# EAGLE design DFROBOT DS3231M (EAGLE 9.7.0)
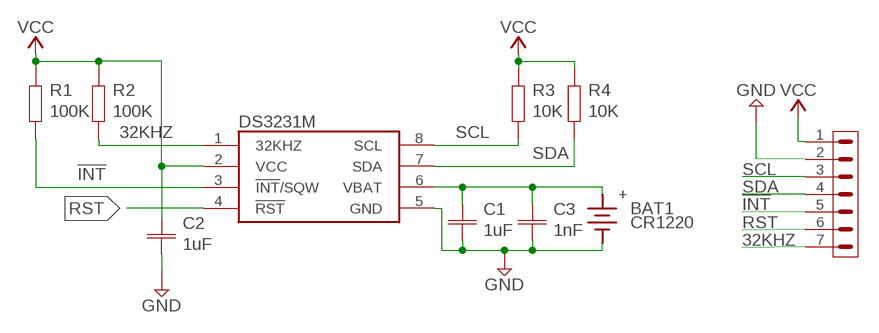
[diagram p0: schematic, sheet 1]

## Parts
BAT1  CR1220  S8411-45R  [S8411-45R]
C1  1uF  C_CHIP-0402(1005-METRIC)  [CAPC1005X60]
C2  1uF  C_CHIP-0402(1005-METRIC)  [CAPC1005X60]
C3  1nF  C_CHIP-0402(1005-METRIC)  [CAPC1005X60]
DS3231M  DS3231MZ+  [SOIC127P600X175-8N]
JP1  PINHD-1X7  DS3231M_HEADERFEMALE  [DS3231M_HEADER]
R1  100K  R_CHIP-0402(1005-METRIC)  [RESC1005X40]
R2  100K  R_CHIP-0402(1005-METRIC)  [RESC1005X40]
R3  10K  R_CHIP-0402(1005-METRIC)  [RESC1005X40]
R4  10K  R_CHIP-0402(1005-METRIC)  [RESC1005X40]

## Nets
32KHZ: DS3231M.1(32KHZ) JP1.7 R2.2
!INT: DS3231M.3(!INT!/SQW) JP1.5 R1.2
GND: BAT1.1(-) C1.2 C2.2 C3.2 DS3231M.5(GND) JP1.2
RST: DS3231M.4(!RST) JP1.6
SCL: DS3231M.8(SCL) JP1.3 R3.2
SDA: DS3231M.7(SDA) JP1.4 R4.2
VBAT: BAT1.2(+) C1.1 C3.1 DS3231M.6(VBAT)
VCC [POWER]: C2.1 DS3231M.2(VCC) JP1.1 R1.1 R2.1 R3.1 R4.1

## Library data of the parts
BAT1 = RTC DFRobot DS3231M:S8411-45R: CR1220 Coin cell battery holder
C1-C3 = Capacitor:C: Capacitor - Generic; CATEGORY: Capacitor; PACKAGE_SIZE: 0402; PACKAGE_TYPE: Surface Mount; SUBCATEGORY: Ceramic Capacitors; TYPE: MLCC
DS3231M = RTC DFRobot DS3231M:DS3231MZ+: Real Time Clock 5+/-ppm RTC Source: Datasheet <http://datasheets.maximintegrated.com/en/ds/DS3231M.pdf>; DESCRIPTION: Real Time Clock 5+/-ppm RTC; HEIGHT: 1.75mm; MANUFACTURER_NAME: Analog Devices; MANUFACTURER_PART_NUMBER: DS3231MZ+; MOUSER_PART_NUMBER: 700-DS3231MZ+; MOUSER_PRICE-STOCK: https://www.mouser.co.uk/ProductDetail/Analog-Devices-Maxim-Integrated/DS3231MZ%2b?qs=4Rc5iGDDRGgASPOHxzykqQ%3D%3D
JP1 = RTC DFRobot DS3231M:DS3231M_HEADER; CATEGORY: Connectors; DESCRIPTION: Header-Straight-7 Position; PACKAGE_TYPE: Through Hole; PITCH: 0.100" (2.54mm); SUBCATEGORY: Headers; TYPE: Male Pins
R1-R4 = Resistor:R: Resistor Fixed - Generic; CATEGORY: Resistors; DESCRIPTION: Chip Resistor 1.05 X 0.54 X 0.40 mm body 0402(1005-METRIC) Package; PACKAGE_SIZE: 0402; PACKAGE_TYPE: Surface Mount

## Board
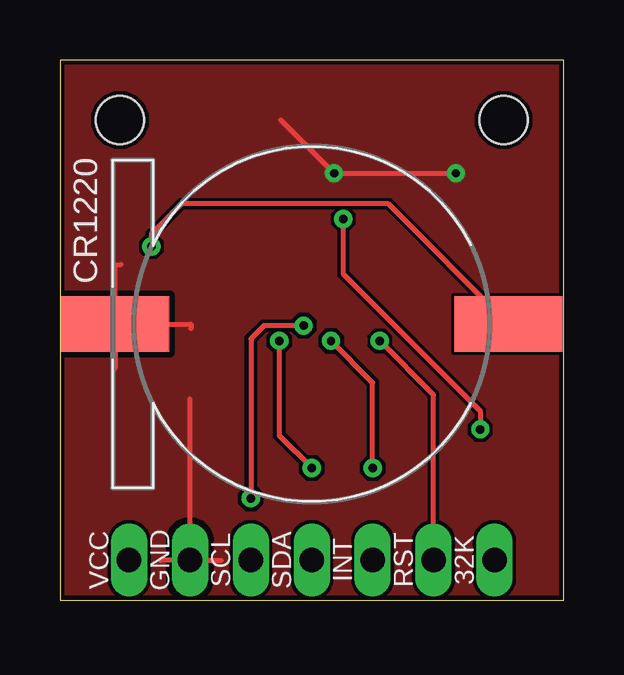
[diagram p1: board, top side]
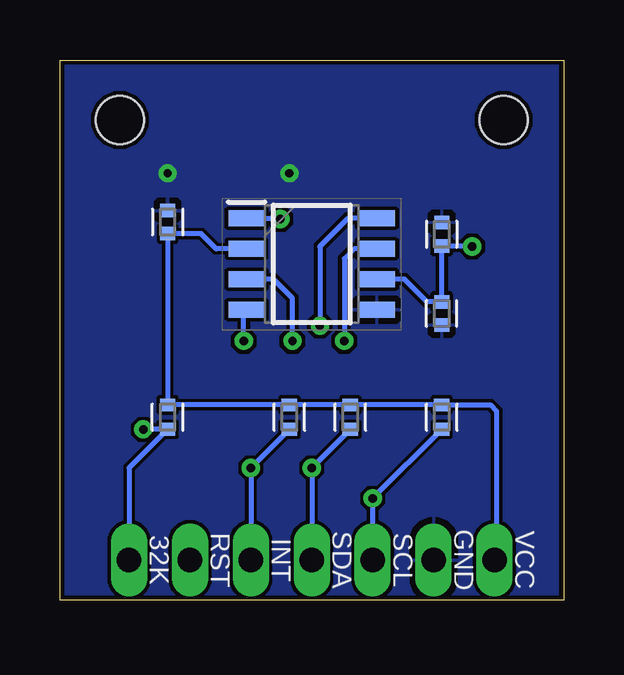
[diagram p2: board, bottom side, seen from below]

Size 21 x 22.5 mm. Coordinates in mm from the lower left corner, seen from the top.
Outline: 0,0 21,0 21,22.5 0,22.5 0,0
Copper layers (1*16): Top / Bottom
Stack-up Default Layer Stack: Top User Defined 0.035mm / Dielectric-1 User Defined 1.5mm / Bottom User Defined 0.035mm
Design rules: minimum copper width 6mil, minimum drill size 0.35mm, copper clearance wire_polygon to wire_polygon 6mil, copper clearance wire_polygon to pad_smd 6mil, copper clearance wire_polygon to via 6mil, copper clearance pad_smd to pad_smd 6mil, copper clearance pad_smd to via 6mil, copper clearance via to via 6mil, copper clearance smd to pad (same net) 6mil, copper clearance smd to via (same net) 6mil, copper clearance smd to smd (same net) 6mil, dimension clearance all to all 0.2mm, dimension clearance 40mil, restrict clearance 0mil, via restrict clearance 0mil, drill distance 6mil, keepout clearance 0mil
Holes 2 mm at 2.5,20 18.5,20

### Footprints (pad centres in the part's own frame; a part is rotated, then mirrored left to right if it is on the bottom)
S8411-45R = smd 2.3 x 4.5: 1 0,-6.93; 2 0,9.47
CAPC1005X60 = smd 0.56 x 0.629: 1 -0.485,0; 2 0.485,0
SOIC127P600X175-8N = smd 1.525 x 0.65: 1 -2.712,1.905; 2 -2.712,0.635; 3 -2.712,-0.635; 4 -2.712,-1.905; 5 2.712,-1.905; 6 2.712,-0.635; 7 2.712,0.635; 8 2.712,1.905
DS3231M_HEADER = drill 1.016 long: 1 -7.62,0; 2 -5.08,0; 3 -2.54,0; 4 0,0; 5 2.54,0; 6 5.08,0; 7 7.62,0
RESC1005X40 = smd 0.535 x 0.644: 1 -0.507,0; 2 0.507,0

### Placement (x,y rotation side)
BAT1  9.23,11.5 270 top
C1  5.08,15.24 90 bottom
C2  16.51,15.75 90 bottom
C3  5.08,11.94 270 bottom
DS3231M  10.5,14 0 bottom
JP1  10.5,1.67 0 top
R1  11.43,7.62 270 bottom
R2  16.51,7.62 270 bottom
R3  5.08,7.62 270 bottom
R4  8.89,7.62 270 bottom

### Tracks (layer width: path | path; a pad name or v marks a point on that pad's centre or on a via)
32KHZ  (via drill 0.35)
  Top 0.2: v11.81,15.88 11.81,13.59 17.53,7.87 v17.53,7.11
  Bottom 0.2: JP1.7 18.12,5.5 R2.2 v17.53,7.11 | v17.53,7.11 | DS3231M.1 11.84,15.9 v11.81,15.88
!INT  (via drill 0.35)
  Top 0.2: v13.04,5.5 13.04,9.06 v11.3,10.79
  Bottom 0.2: R1.2 v13.04,5.5 JP1.5 | v11.3,10.79 11.3,12.57 12.1,13.37 DS3231M.3
GND  (via drill 0.35)
  Top 0.2: 2.5,11.7 BAT1.1 | JP1.2 5.42,8.38 | 9.21,20 v11.43,17.78 v16.51,17.78 16.51,18.01 | 5.42,1.65 4.19,1.65 4.19,1.67 JP1.2 | JP1.2 5.42,1.65 | 5.42,1.65 6.73,1.65 | BAT1.1 2.3,13.97 2.54,13.97 | BAT1.1 2.3,9.65 2.29,9.65 | BAT1.1 5.46,11.5 5.46,11.3
  pour Top: 0,22.5 0,0 21,0 21,22.5
  pour Bottom: 0,22.5 0,0 21,0 21,22.5
RST  (via drill 0.35)
  Top 0.2: JP1.6 15.58,8.55 v13.34,10.79
  Bottom 0.2: v13.34,10.79 13.34,11.97 DS3231M.4
SCL  (via drill 0.35)
  Top 0.2: v10.16,11.43 8.51,11.43 7.96,10.88 v7.96,4.23
  Bottom 0.2: R3.2 v7.96,4.23 JP1.3 | DS3231M.8 8.99,15.9 10.16,14.73 v10.16,11.43
SDA  (via drill 0.35)
  Top 0.2: v9.14,10.79 9.14,6.86 v10.5,5.5
  Bottom 0.2: R4.2 v10.5,5.5 JP1.4 | DS3231M.7 8.73,14.63 9.14,14.22 v9.14,10.79
VBAT  (via drill 0.35)
  Top 0.2: BAT1.2 13.69,16.51 5.08,16.51 3.81,15.24 v3.81,14.73
  Bottom 0.2: DS3231M.6 6.63,13.37 5.69,12.42 C3.1 C1.1 3.83,14.76 v3.81,14.73
VCC
  Bottom 0.2: JP1.1 2.79,1.76 2.79,7.87 3.05,8.13 R3.1 R4.1 R1.1 R2.1 C2.1 15.11,15.26 14.48,14.63 DS3231M.2